# EAGLE schematic Programming headers (EAGLE 8.2.1)
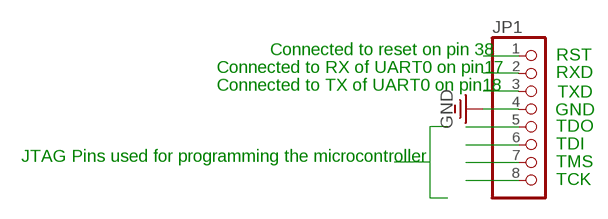
[diagram p0: schematic, sheet 1]

## Parts
JP1  PINHD-1X8-3.5MM  [1X08-3.5MM]

## Nets
GND [VSERVO]: JP1.4
N$11: JP1.8
N$15: JP1.7
N$25: JP1.6
N$31: JP1.5
RST: JP1.1
RX: JP1.2
TX: JP1.3

## Notes on the sheet
- Connected to reset on pin 38
- RST
- Connected to RX of UART0 on pin17
- RXD
- Connected to TX of UART0 on pin18
- TXD
- GND
- TDO
- TDI
- JTAG Pins used for programming the microcontroller
- TMS
- TCK

## Library data of the parts
JP1 = adafruit:PINHD-1X8: PIN HEADER

## Net classes
0 default: width 0.2 mm, clearance 0.2 mm
1 VSERVO: width 0.8 mm, clearance 0.2 mm